# EAGLE schematic Caffeine (EAGLE 7.1.0)
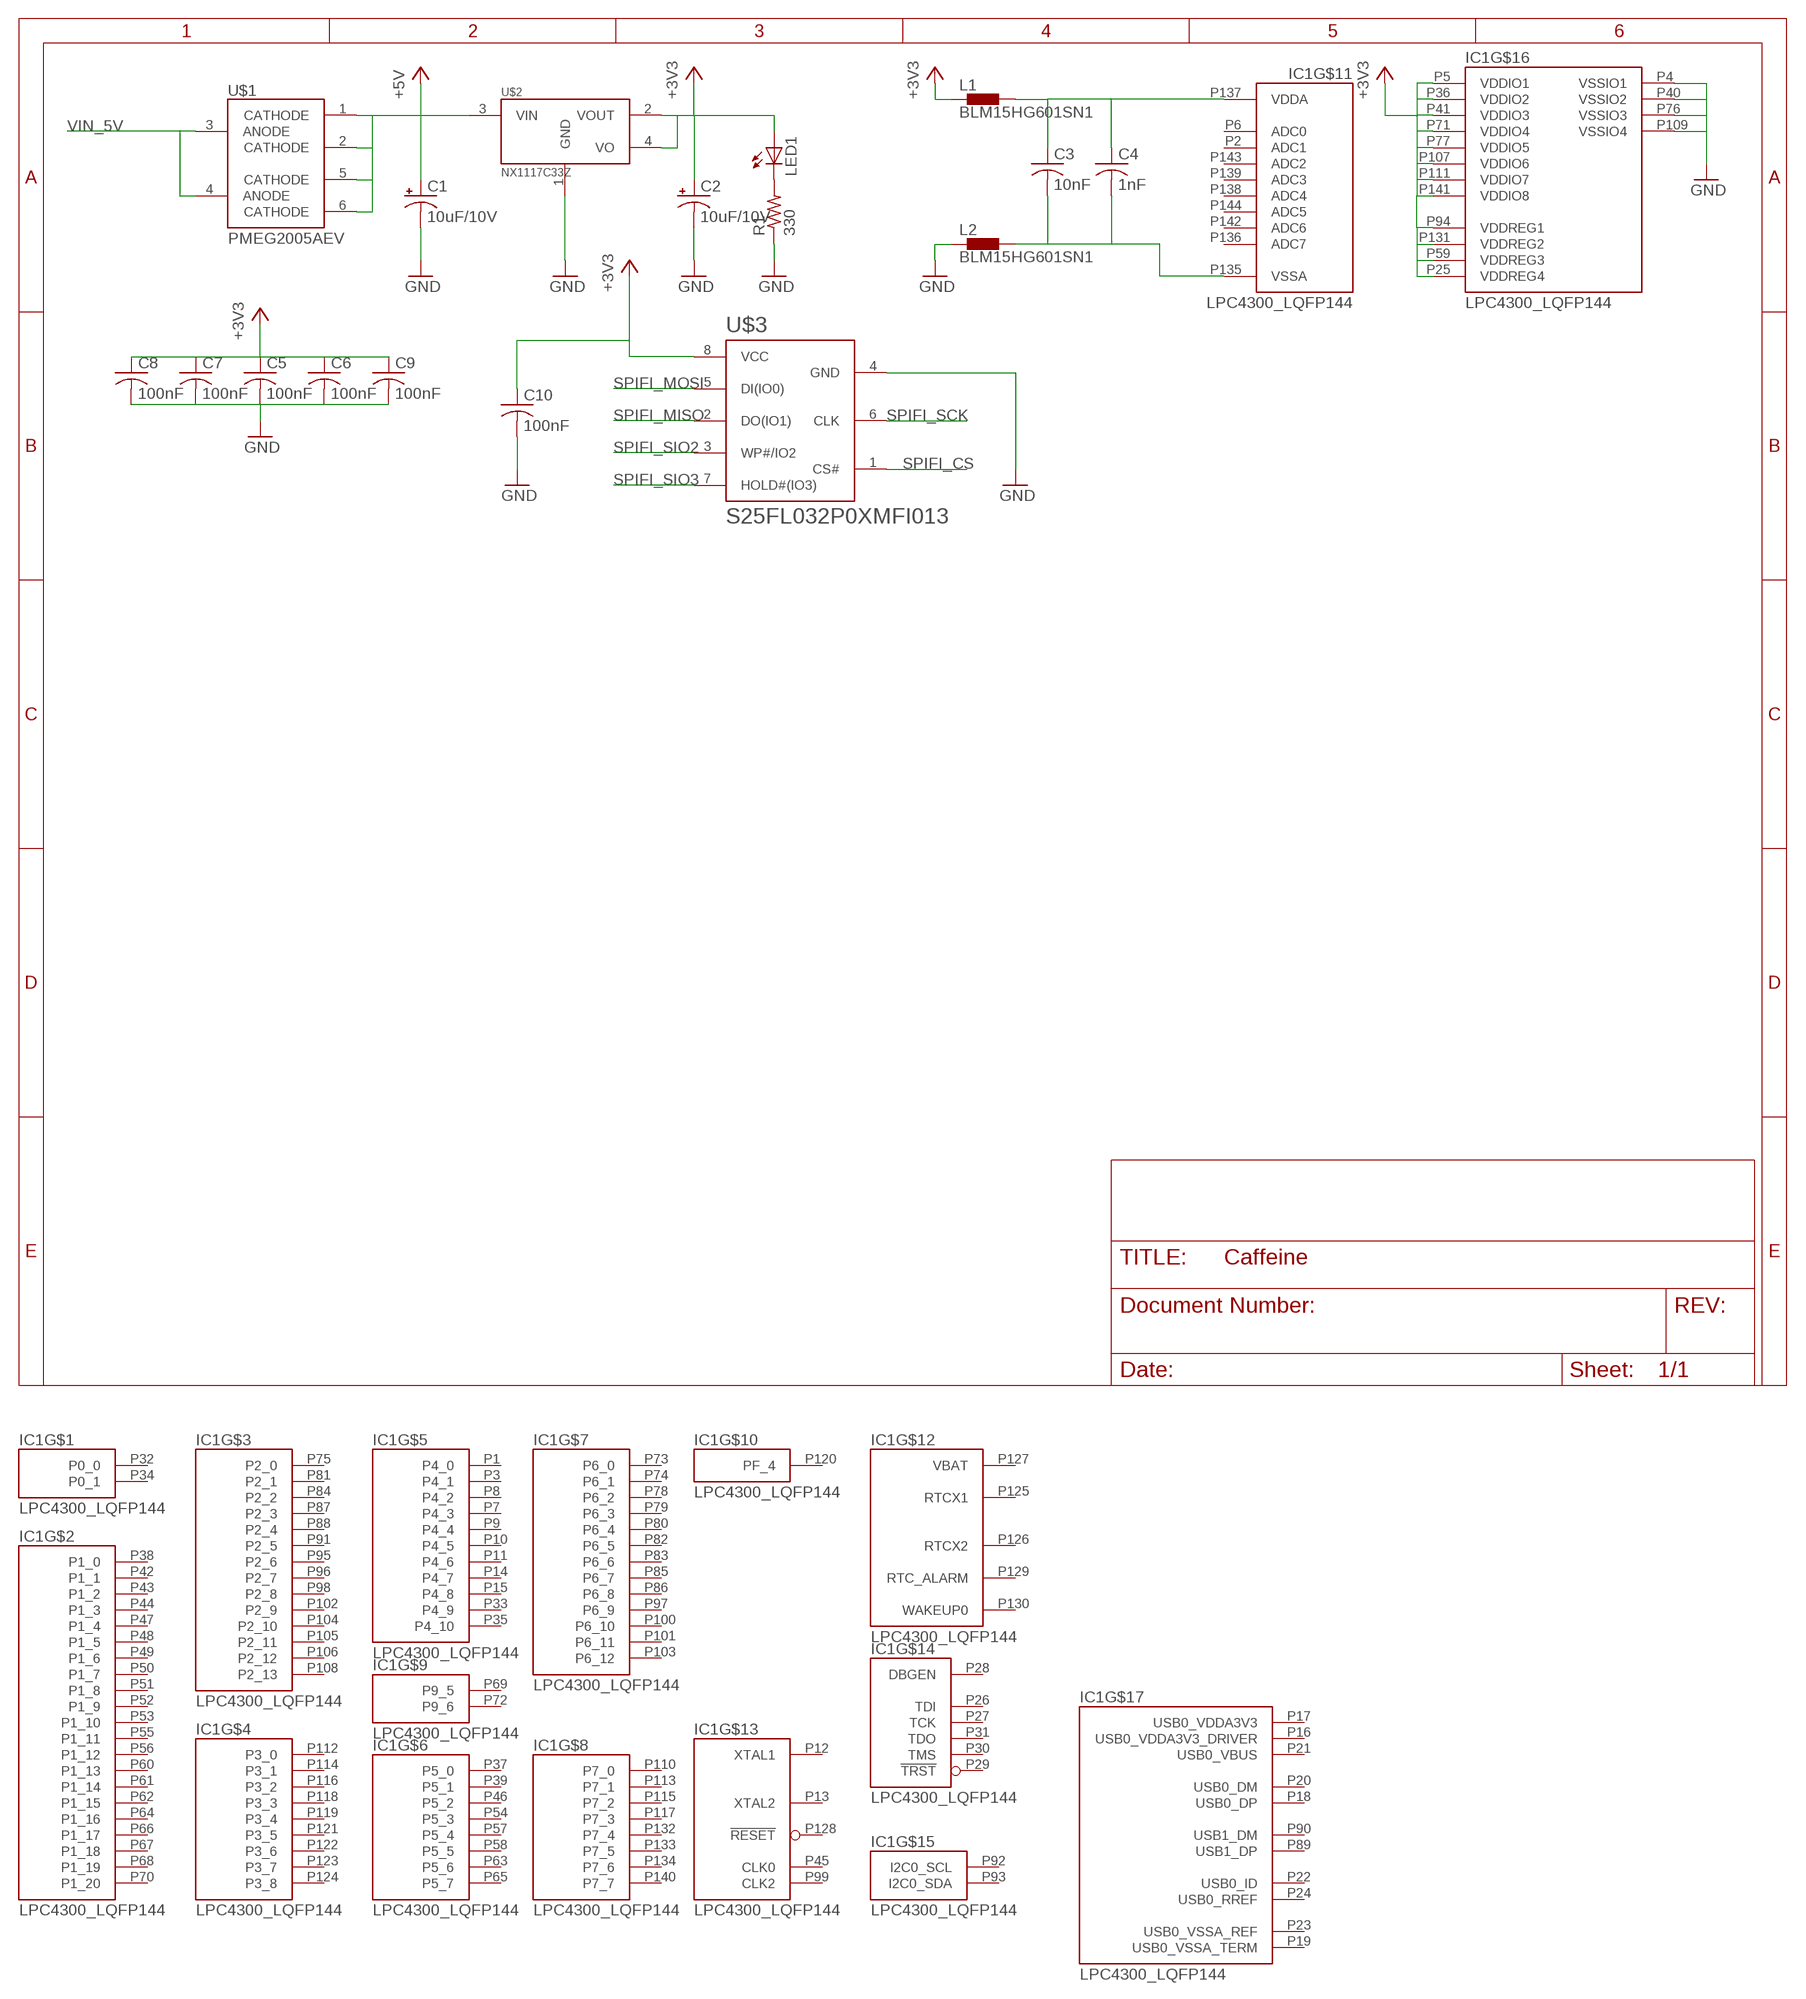
[diagram p0: schematic, sheet 1]

## Parts
C1  10uF/10V  CPOL-USCT3216  [CT3216]
C2  10uF/10V  CPOL-USCT3216  [CT3216]
C3  10nF  C-USC1206  [C1206]
C4  1nF  C-USC1206  [C1206]
C5  100nF  C-USC1206  [C1206]
C6  100nF  C-USC1206  [C1206]
C7  100nF  C-USC1206  [C1206]
C8  100nF  C-USC1206  [C1206]
C9  100nF  C-USC1206  [C1206]
C10  100nF  C-USC1206  [C1206]
IC1  LPC4300_LQFP144  [LQFP144]
L1  BLM15HG601SN1  [0402]
L2  BLM15HG601SN1  [0402]
LED1  LEDCHIPLED_1206  [CHIPLED_1206]
R1  330  R-US_R1206  [R1206]
U$1  PMEG2005AEV  [SOT666]
U$2  NX1117C33Z  [SOT223]
U$3  S25FL032P0XMFI013  [SOC008]

## Nets
+3V3: C2.+ C5.1 C6.1 C7.1 C8.1 C9.1 C10.1 IC1.P5(VDDIO1) IC1.P25(VDDREG4) IC1.P36(VDDIO2) IC1.P41(VDDIO3) IC1.P59(VDDREG3) IC1.P71(VDDIO4) IC1.P77(VDDIO5) IC1.P94(VDDREG1) IC1.P107(VDDIO6) IC1.P111(VDDIO7) IC1.P131(VDDREG2) IC1.P141(VDDIO8) L1.1 LED1.A U$2.2(VOUT) U$2.4(VO) U$3.8(VCC)
+5V: C1.+ U$1.1(CATHODE) U$1.2(CATHODE) U$1.5(CATHODE) U$1.6(CATHODE) U$2.3(VIN)
GND: C1.- C2.- C5.2 C6.2 C7.2 C8.2 C9.2 C10.2 IC1.P4(VSSIO1) IC1.P40(VSSIO2) IC1.P76(VSSIO3) IC1.P109(VSSIO4) L2.1 R1.1 U$2.1(GND) U$3.4(GND)
N$2: LED1.C R1.2
SPIFI_CS: U$3.1(CS#)
SPIFI_MISO: U$3.2(DO(IO1))
SPIFI_MOSI: U$3.5(DI(IO0))
SPIFI_SCK: U$3.6(CLK)
SPIFI_SIO2: U$3.3(WP#/IO2)
SPIFI_SIO3: U$3.7(HOLD#(IO3))
VDDA: C3.1 C4.1 IC1.P137(VDDA) L1.2
VIN_5V: U$1.3(ANODE) U$1.4(ANODE)
VSSA: C3.2 C4.2 IC1.P135(VSSA) L2.2
Unconnected: IC1.P1(P4_0) IC1.P2(ADC1) IC1.P3(P4_1) IC1.P6(ADC0) IC1.P7(P4_3) IC1.P8(P4_2) IC1.P9(P4_4) IC1.P10(P4_5) IC1.P11(P4_6) IC1.P12(XTAL1) IC1.P13(XTAL2) IC1.P14(P4_7) IC1.P15(P4_8) IC1.P16(USB0_VDDA3V3_DRIVER) IC1.P17(USB0_VDDA3V3) IC1.P18(USB0_DP) IC1.P19(USB0_VSSA_TERM) IC1.P20(USB0_DM) IC1.P21(USB0_VBUS) IC1.P22(USB0_ID) IC1.P23(USB0_VSSA_REF) IC1.P24(USB0_RREF) IC1.P26(TDI) IC1.P27(TCK) IC1.P28(DBGEN) IC1.P29(!TRST) IC1.P30(TMS) IC1.P31(TDO) IC1.P32(P0_0) IC1.P33(P4_9) IC1.P34(P0_1) IC1.P35(P4_10) IC1.P37(P5_0) IC1.P38(P1_0) IC1.P39(P5_1) IC1.P42(P1_1) IC1.P43(P1_2) IC1.P44(P1_3) IC1.P45(CLK0) IC1.P46(P5_2) IC1.P47(P1_4) IC1.P48(P1_5) IC1.P49(P1_6) IC1.P50(P1_7) IC1.P51(P1_8) IC1.P52(P1_9) IC1.P53(P1_10) IC1.P54(P5_3) IC1.P55(P1_11) IC1.P56(P1_12) IC1.P57(P5_4) IC1.P58(P5_5) IC1.P60(P1_13) IC1.P61(P1_14) IC1.P62(P1_15) IC1.P63(P5_6) IC1.P64(P1_16) IC1.P65(P5_7) IC1.P66(P1_17) IC1.P67(P1_18) IC1.P68(P1_19) IC1.P69(P9_5) IC1.P70(P1_20) IC1.P72(P9_6) IC1.P73(P6_0) IC1.P74(P6_1) IC1.P75(P2_0) IC1.P78(P6_2) IC1.P79(P6_3) IC1.P80(P6_4) IC1.P81(P2_1) IC1.P82(P6_5) IC1.P83(P6_6) IC1.P84(P2_2) IC1.P85(P6_7) IC1.P86(P6_8) IC1.P87(P2_3) IC1.P88(P2_4) IC1.P89(USB1_DP) IC1.P90(USB1_DM) IC1.P91(P2_5) IC1.P92(I2C0_SCL) IC1.P93(I2C0_SDA) IC1.P95(P2_6) IC1.P96(P2_7) IC1.P97(P6_9) IC1.P98(P2_8) IC1.P99(CLK2) IC1.P100(P6_10) IC1.P101(P6_11) IC1.P102(P2_9) IC1.P103(P6_12) IC1.P104(P2_10) IC1.P105(P2_11) IC1.P106(P2_12) IC1.P108(P2_13) IC1.P110(P7_0) IC1.P112(P3_0) IC1.P113(P7_1) IC1.P114(P3_1) IC1.P115(P7_2) IC1.P116(P3_2) IC1.P117(P7_3) IC1.P118(P3_3) IC1.P119(P3_4) IC1.P120(PF_4) IC1.P121(P3_5) IC1.P122(P3_6) IC1.P123(P3_7) IC1.P124(P3_8) IC1.P125(RTCX1) IC1.P126(RTCX2) IC1.P128(!RESET) IC1.P129(RTC_ALARM) IC1.P130(WAKEUP0) IC1.P132(P7_4) IC1.P133(P7_5) IC1.P134(P7_6) IC1.P136(ADC7) IC1.P138(ADC4) IC1.P139(ADC3) IC1.P140(P7_7) IC1.P142(ADC6) IC1.P143(ADC2) IC1.P144(ADC5)

## Power pins joined to a net without a drawn wire
VBAT: IC1.P127(VBAT)

## Library data of the parts
C1 C2 = rcl:CPOL-US: POLARIZED CAPACITOR, American symbol
C3-C10 = resistor:C-US: CAPACITOR, American symbol
IC1 = LPC4300:LPC4300_LQFP144: LQFP144 - SOT486-1 LQFP144: plastic low profile quad flat package; 144 leads; body 20 x 20 x 1.4 mm body + leads 22 x 22 mm Solderland (pads) 0.4 x 1.5 mm on corners (8 x) and 0.28 x 1.5 mm (136 x)
L1 L2 = inductors:BLM15H: EMIFIL (R) Chip Ferrite Bead for GHz Noise Source: http://www.murata.com/ Ferrite Bead BLM15H.pdf
LED1 = led:LED: LED OSRAM: - CHIPLED LG R971, LG N971, LY N971, LG Q971, LY Q971, LO R971, LY R971 LH N974, LH R974 LS Q976, LO Q976, LY Q976 LO Q996 - Hyper CHIPLED LW Q18S LB Q993, LB Q99A, LB R99A - SideLED LS A670, LO A670, LY A670, LG A670, LP A670 LB A673, LV A673, LT A673, LW A673 LH A674 LY A675 LS A676, LA A676, LO A676, LY A676, LW A676 LS A679, LY A679, LG A679 - Hyper Micro SIDELED® LS Y876, LA Y876, LO Y876, LY Y876 LT Y87S - SmartLED LW L88C, LW L88S LB L89C, LB L89S, LG L890 LS L89K, LO L89K, LY L89K LS L896, LA L896, LO L896, LY L896 - TOPLED LS T670, LO T670, LY T670, LG T670, LP T670 LSG T670, LSP T670, LSY T670, LOP T670, LYG T670 LG T671, LOG T671, LSG T671 LB T673, LV T673, LT T673, LW T673 LH T674 LS T676, LA T676, LO T676, LY T676, LB T676, LH T676, LSB T676, LW T676 LB T67C, LV T67C, LT T67C, LS T67K, LO T67K, LY T67K, LW E67C LS E67B, LA E67B, LO E67B, LY E67B, LB E67C, LV E67C, LT E67C LW T67C LS T679, LY T679, LG T679 LS T770, LO T770, LY T770, LG T770, LP T770 LB T773, LV T773, LT T773, LW T773 LH T774 LS E675, LA E675, LY E675, LS T675 LS T776, LA T776, LO T776, LY T776, LB T776 LHGB T686 LT T68C, LB T68C - Hyper Mini TOPLED® LB M676 - Mini TOPLED Santana® LG M470 LS M47K, LO M47K, LY M47K Source: http://www.osram.convergy.de LUXEON: - LUMILED® LXK2-PW12-R00, LXK2-PW12-S00, LXK2-PW14-U00, LXK2-PW14-V00 LXK2-PM12-R00, LXK2-PM12-S00, LXK2-PM14-U00 LXK2-PE12-Q00, LXK2-PE12-R00, LXK2-PE12-S00, LXK2-PE14-T00, LXK2-PE14-U00 LXK2-PB12-K00, LXK2-PB12-L00, LXK2-PB12-M00, LXK2-PB14-N00, LXK2-PB14-P00, LXK2-PB14-Q00 LXK2-PR12-L00, LXK2-PR12-M00, LXK2-PR14-Q00, LXK2-PR14-R00 LXK2-PD12-Q00, LXK2-PD12-R00, LXK2-PD12-S00 LXK2-PH12-R00, LXK2-PH12-S00 LXK2-PL12-P00, LXK2-PL12-Q00, LXK2-PL12-R00 Source: www.luxeon.com KINGBRIGHT: KA-3528ASYC Source: www.kingbright.com
R1 = rcl:R-US_: RESISTOR, American symbol
U$1 = caffeine:PMEG2005AEV
U$2 = caffeine:NX1117C33Z
U$3 = caffeine:S25FL032P0XMFI013